# Altium schematic sheet Sheet06.SchDoc
size A4
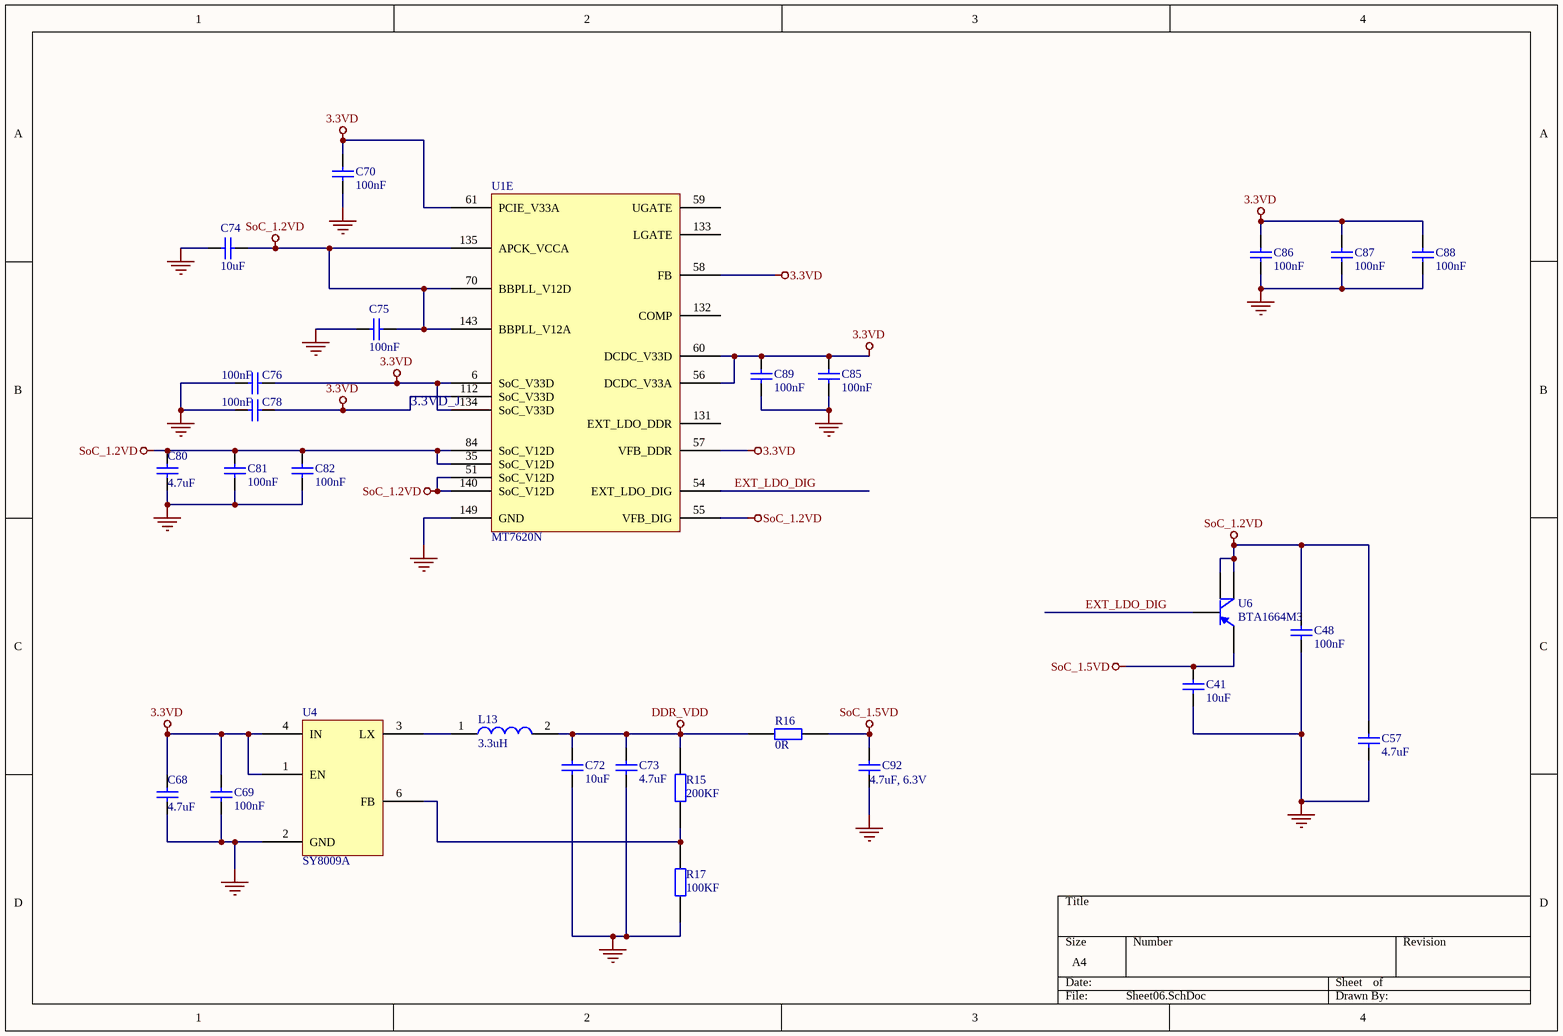
[diagram p0: Sheet06.SchDoc]

## Parts
C41  10uF  [R0805]
C48  100nF  [R0402]
C57  4.7uF  [R0603]
C68  4.7uF  [R0603]
C69  100nF  [R0402]
C70  100nF  [R0402]
C72  10uF  [R0805]
C73  4.7uF  [R0603]
C74  10uF  [R0805]
C75  100nF  [R0402]
C76  100nF  [R0402]
C78  100nF  [R0402]
C80  4.7uF  [R0603]
C81  100nF  [R0402]
C82  100nF  [R0402]
C85  100nF  [R0402]
C86  100nF  [R0402]
C87  100nF  [R0402]
C88  100nF  [R0402]
C89  100nF  [R0402]
C92  4.7uF, 6.3V  [R0603]
L13  3.3uH  [LSMD3_8x3_8]
R15  200KF  [R0402]
R16  0R  [R1206]
R17  100KF  [R0402]
U1  MT7620N  [QFN-148-RT]  (part E of 5)
U4  SY8009A  [SOT23-6L]
U6  BTA1664M3  [SOT-89]

## Nets
3.3VD: C68.2 C69.1 C70.1 C76.1 C78.1 C85.1 C86.1 C87.1 C88.1 C89.1 U1.6(SoC_V33D) U1.56(DCDC_V33A) U1.57(VFB_DDR) U1.58(FB) U1.60(DCDC_V33D) U1.61(PCIE_V33A) U1.112(SoC_V33D) U1.134(SoC_V33D) U4.1(EN) U4.4(IN)
DDR_VDD: C72.1 C73.1 L13.2 R15.1 R16.1
GND: C41.2 C48.2 C57.2 C68.1 C69.2 C70.2 C72.2 C73.2 C74.2 C75.1 C76.2 C78.2 C80.1 C81.2 C82.2 C85.2 C86.2 C87.2 C88.2 C89.2 C92.1 R17.2 U1.149(GND) U4.2(GND)
SoC_1.2VD: C48.1 C57.1 C74.1 C75.2 C80.2 C81.1 C82.1 U1.35(SoC_V12D) U1.51(SoC_V12D) U1.55(VFB_DIG) U1.70(BBPLL_V12D) U1.84(SoC_V12D) U1.135(APCK_VCCA) U1.140(SoC_V12D) U1.143(BBPLL_V12A) U6.2(C) U6.4(C)
SoC_1.5VD: C41.1 C92.2 R16.2 U6.3(E)
EXT_LDO_DIG: U1.54(EXT_LDO_DIG) U6.1(B)
NetL13_1: L13.1 U4.3(LX)
NetR15_2: R15.2 R17.1 U4.6(FB)

Not connected (* = marked no-connect by the designer): U1 59(UGATE) 131(EXT_LDO_DDR) 132(COMP) 133(LGATE)

## Notes on the sheet
- 3.3VD_J

## Library data of the parts
C41 C48 C57 C92 = Cap Semi: Capacitor (Semiconductor SIM Model); Manufacturer: Generic Components; Class: Passive; Value: 0.1uF; Published: 08/06/2000; Publisher: Altium Hobart Technology Centre; SubClass: Capacitor
C68-C70 C72-C76 C78 C80-C82 C85-C89 = Cap Semi: 2pF, 50V, +/-0.25pF; Manufacturer: Generic Components; Class: Passive; SubClass: Capacitor; Value: 0.1uF; Published: 08/06/2000; Publisher: Altium Hobart Technology Centre
L13 = INDUCTOR
R15-R17 = RES
U4 = SY8008C